# Altium schematic sheet BUCK.SchDoc
size A4; SheetNumber: 4; SheetTotal: 4
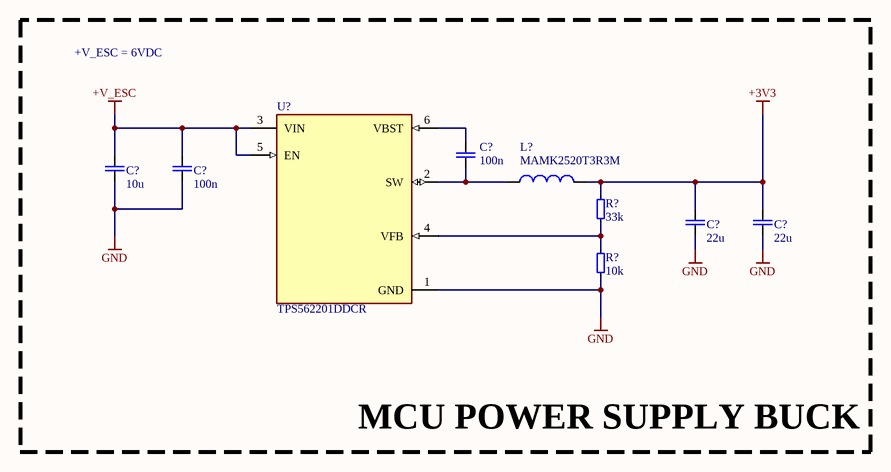
[diagram p0: BUCK.SchDoc]

## Parts
(Parts that share a designator on the sheet are numbered #1, #2 ... from top to bottom, then left to right.)
C?#1  100n  [C0402]
C?#2  10u  [C0603]
C?#3  100n  [C0603]
C?#4  22u  [C0603]
C?#5  22u  [C0603]
L?  MAMK2520T3R3M  [INDC2520X120N]
R?#1  33k  [R0402]
R?#2  10k  [R0402]
U?  TPS562201DDCR  [SOT95P280X110-6N]

## Nets
+3V3: C?#4.2 C?#5.2 L?.2 R?#1.2
+V_ESC: C?#2.2 C?#3.2 U?.3(VIN) U?.5(EN)
GND: C?#2.1 C?#3.1 C?#4.1 C?#5.1 R?#2.1 U?.1(GND)
NetC?#1_1: C?#1.1 L?.1 U?.2(SW)
NetC?#1_2: C?#1.2 U?.6(VBST)
NetR?#1_1: R?#1.1 R?#2.2 U?.4(VFB)

## Notes on the sheet
- +V_ESC = 6VDC
- MCU POWER SUPPLY BUCK

## Library data of the parts
C?#1 = CMP-00023-15: Generic SMD 0402 Ceramic Capacitor
C?#2-C?#5 = CMP-00024-8: Generic 0603 SMD Ceramic Capacitor
L? = MAMK2520T3R3M: 3.3 ÂµH Shielded Drum Core, Wirewound Inductor 1.7 A 156mOhm Max 1008 (2520 Metric); MF: Taiyo Yuden; SnapEDA_Link: https://www.snapeda.com/parts/MAMK2520T3R3M/Taiyo+Yuden/view-part/?ref=snap; Package: 2520 Taiyo Yuden; Value: *; MP: MAMK2520T3R3M; Check_prices: https://www.snapeda.com/parts/MAMK2520T3R3M/Taiyo+Yuden/view-part/?ref=eda
R?#1 R?#2 = CMP-00016-11: Generic 0402 SMD Resistor
U? = TPS562201DDCR: 4.5 V to 17 V input, 2 A output, synchronous step-down converter in Eco-mode; MF: Texas Instruments; SnapEDA_Link: https://www.snapeda.com/parts/TPS562201DDCR/Texas+Instruments/view-part/?ref=snap; Package: SOT-23-THN-6 Texas Instruments; Value: *; MP: TPS562201DDCR; Check_prices: https://www.snapeda.com/parts/TPS562201DDCR/Texas+Instruments/view-part/?ref=eda